# Altium schematic sheet OSSI-1 OBC_0.SchDoc: TITLE:
size 410 x 286 mm; Date: Date:; >LAST_DATE_TIME: 01/11/2015 13:38:39; Sheet:: Sheet:; >SHEET: 1; REV:: REV:; Document Number:: Document Number:; >DRAWING_NAME: OSSI-1 OBC.sch
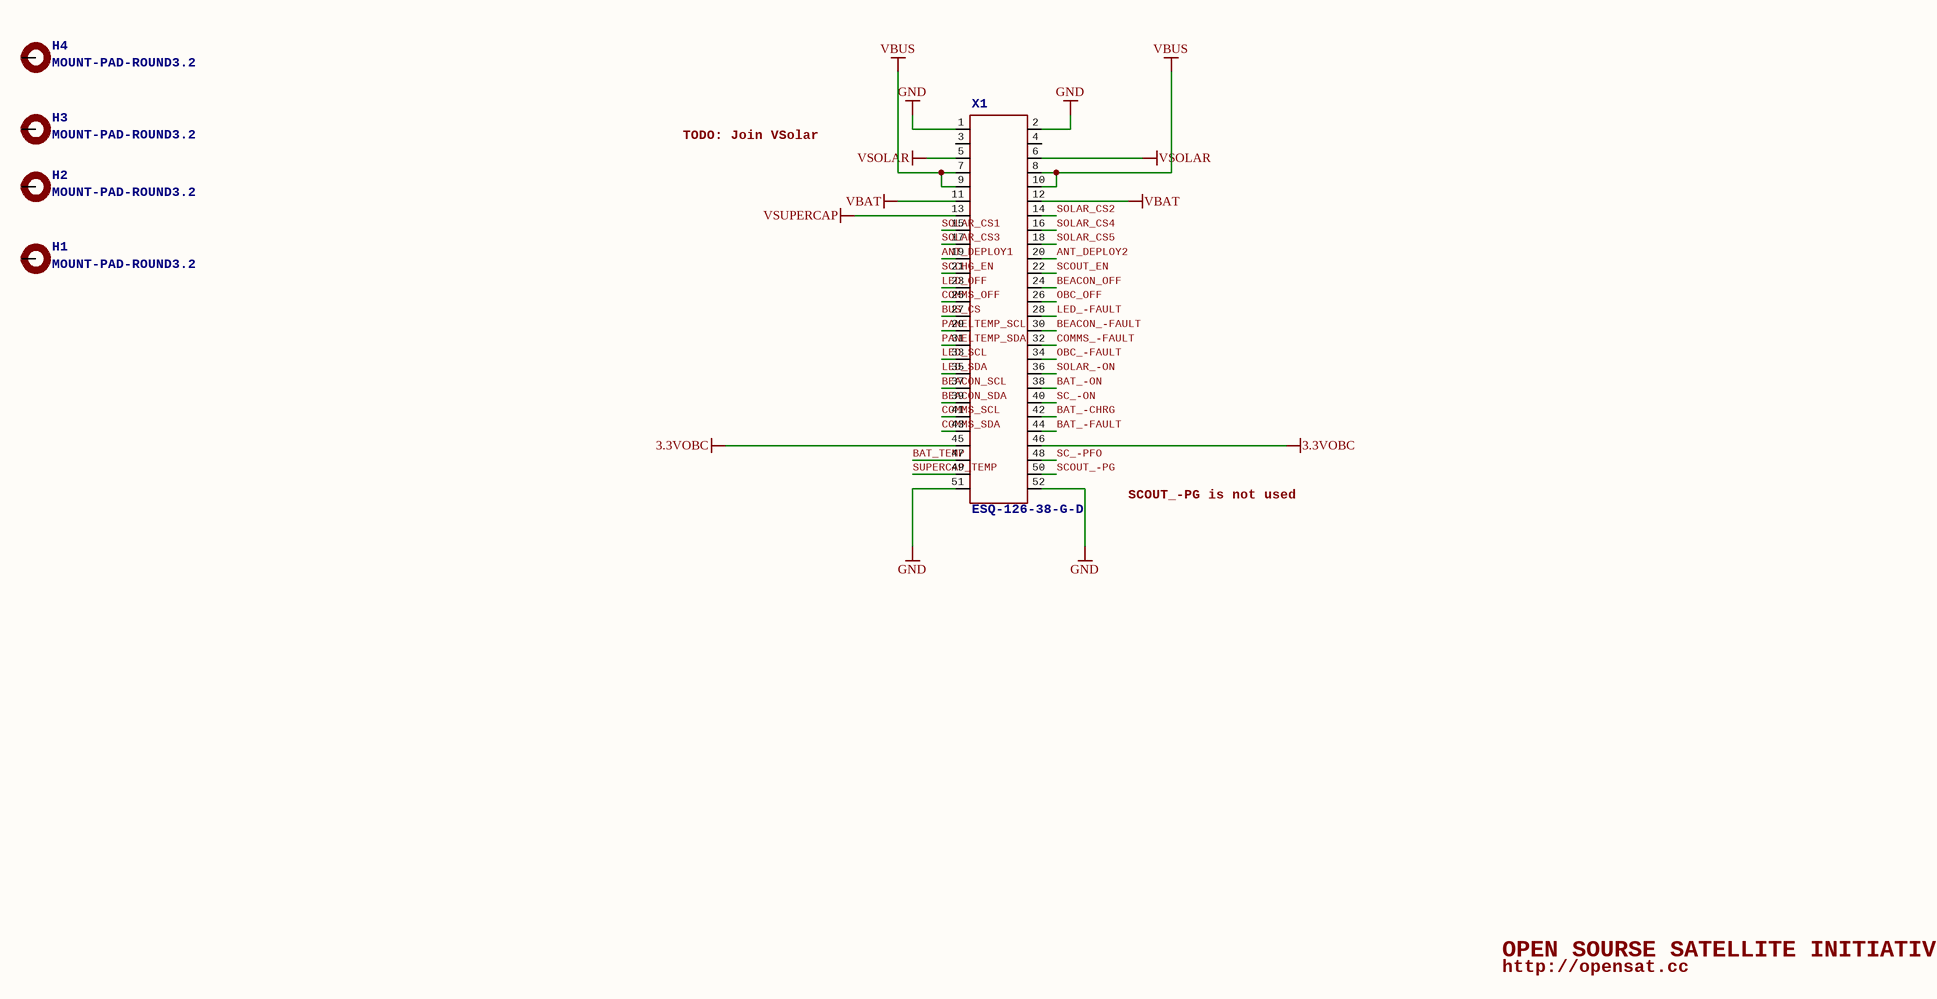
[diagram p0: OSSI-1 OBC_0.SchDoc]

## Parts
H1  >NAME: H1  [3.2-PAD-ROUND]  (hidden comment: MOUNT-PAD-ROUND3.2)
H2  >NAME: H2  [3.2-PAD-ROUND]  (hidden comment: MOUNT-PAD-ROUND3.2)
H3  >NAME: H3  [3.2-PAD-ROUND]  (hidden comment: MOUNT-PAD-ROUND3.2)
H4  >NAME: H4  [3.2-PAD-ROUND]  (hidden comment: MOUNT-PAD-ROUND3.2)
X1  >NAME: X1  [ESQ-126-XX-X-D]  (hidden comment: ESQ-126-38-G-D)

## Nets
3.3VOBC: X1.45 X1.46
GND: X1.1 X1.2 X1.51 X1.52
VBAT: X1.11 X1.12
VBUS: X1.7 X1.8 X1.9 X1.10
VSOLAR: X1.5 X1.6
VSUPERCAP: X1.13
ANT_DEPLOY1: X1.19
ANT_DEPLOY2: X1.20
BAT_-CHRG: X1.42
BAT_-FAULT: X1.44
BAT_-ON: X1.38
BAT_TEMP: X1.47
BEACON_-FAULT: X1.30
BEACON_OFF: X1.24
BEACON_SCL: X1.37
BEACON_SDA: X1.39
BUS_CS: X1.27
COMMS_-FAULT: X1.32
COMMS_OFF: X1.25
COMMS_SCL: X1.41
COMMS_SDA: X1.43
LED_-FAULT: X1.28
LED_OFF: X1.23
LED_SCL: X1.33
LED_SDA: X1.35
OBC_-FAULT: X1.34
OBC_OFF: X1.26
PANELTEMP_SCL: X1.29
PANELTEMP_SDA: X1.31
SC_-ON: X1.40
SC_-PFO: X1.48
SCCHG_EN: X1.21
SCOUT_-PG: X1.50
SCOUT_EN: X1.22
SOLAR_-ON: X1.36
SOLAR_CS1: X1.15
SOLAR_CS2: X1.14
SOLAR_CS3: X1.17
SOLAR_CS4: X1.16
SOLAR_CS5: X1.18
SUPERCAP_TEMP: X1.49

Not connected (* = marked no-connect by the designer): H1 B3,2(MOUNT); H2 B3,2(MOUNT); H3 B3,2(MOUNT); H4 B3,2(MOUNT); X1 3 4

## Notes on the sheet
- TODO: Join VSolar
- SCOUT_-PG is not used
- OPEN SOURSE SATELLITE INITIATIVE
- http://opensat.cc

## Library data of the parts
X1 = ESQ-126-38-G-D: <b>Samtec ESQ-126-XX-G-D Elevated Sockets Seires</b> / <ul> / <li> ESQ-126-37-G-D</li> / <li> ESQ-126-38-G-D</li> / <li> ESQ-126-39-G-D</li> / </ul>; >VALUE: ESQ-126-38-G-D
H1-H4 = MOUNT-PAD-ROUND3.2: >VALUE: MOUNT-PAD-ROUND3.2